# Altium schematic sheet Schematic.schdoc
size 312 x 225 mm
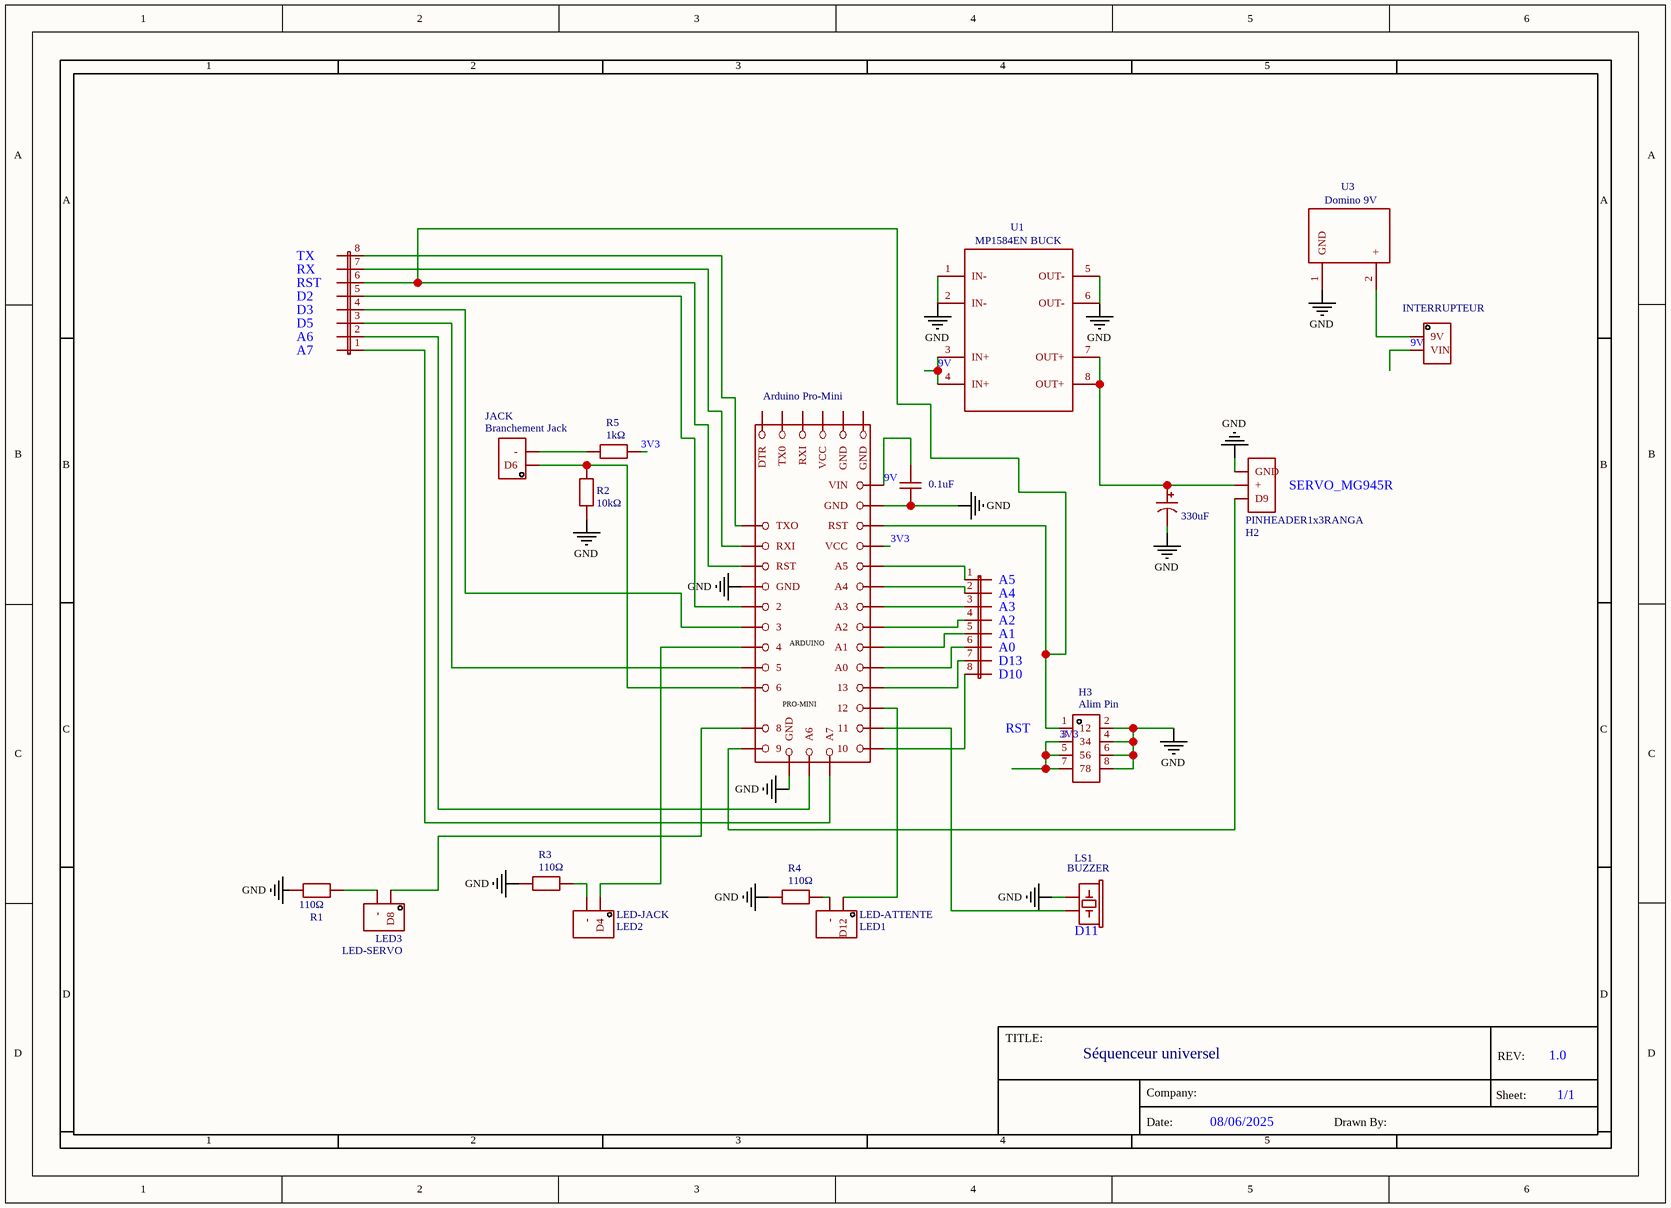
[diagram p0: Schematic.schdoc]

## Parts
C1  330uF  [CAPACITOR, 100UF 2.54MM PIN CAPACITOR]
C2  0.1uF  [CERAMIC CAPACITOR 150MIL]
H2  PINHEADER1x3RANGA  [PINHEADER1X3]
H3  Alim Pin  [HDR-TH_8P-P2.54-V-F-R2-C4-S2.54]
INTERRUPTEUR  KCD1-101A  [PINHEADER1X2]  (value not drawn)
JACK  Branchement Jack  [PINHEADER1X2]
JP1  JUMPER-8-PINS  [CONNECTOR-8-MALE-FEMALE]  (value not drawn)
JP2  JUMPER-8-PINS  [CONNECTOR-8-MALE-FEMALE]  (value not drawn)
LED-ATTENTE  LED1  [PINHEADER1X2]
LED-JACK  LED2  [PINHEADER1X2]
LED-SERVO  LED3  [PINHEADER1X2]
LS1  BUZZER  [BUZZER-12MM-NS]
R1  110Ω  [1W RESISTANCE]
R2  10kΩ  [1W RESISTANCE]
R3  110Ω  [1W RESISTANCE]
R4  110Ω  [1W RESISTANCE]
R5  1kΩ  [1W RESISTANCE]
U1  MP1584EN BUCK  [MP1584EN_MINI_MODULE_BUCK_4.5V-28V]
U2  Arduino Pro-Mini  [ARDUINOPROMINI_ARDUINO_PRO_MINI]
U3  Domino 9V  [PAD_CONN_AWG19]

## Nets
GND: C1.2 C2.1 H2.3(GND) H3.2 H3.4 H3.6 H3.8 LS1.- R1.1 R2.1 R3.1 R4.1 U1.1(IN-) U1.2(IN-) U1.5(OUT-) U1.6(OUT-) U2.GND U2.GND@1(GND) U2.GND@3(GND) U3.1(GND)
3V3: H3.3 H3.5 H3.7 R5.1 U2.VCC
9V: C2.2 INTERRUPTEUR.2(VIN) U1.3(IN+) U1.4(IN+) U2.RAW(VIN)
NetC1_1: C1.1 H2.2(+) U1.7(OUT+) U1.8(OUT+)
NetH2_1: H2.1(D9) U2.D9(9)
NetH3_1: H3.1 JP2.6 U2.RST U2.RST@1(RST)
NetINTERRUPTEUR_1: INTERRUPTEUR.1(9V) U3.2(+)
NetJACK_1: JACK.1(D6) R2.2 U2.D6(6)
NetJACK_2: JACK.2(-) R5.2
NetJP1_1: JP1.1 U2.A5
NetJP1_2: JP1.2 U2.A4
NetJP1_3: JP1.3 U2.A3
NetJP1_4: JP1.4 U2.A2
NetJP1_5: JP1.5 U2.A1
NetJP1_6: JP1.6 U2.A0
NetJP1_7: JP1.7 U2.D13(13)
NetJP1_8: JP1.8 U2.D10(10)
NetJP2_1: JP2.1 U2.A7
NetJP2_2: JP2.2 U2.A6
NetJP2_3: JP2.3 U2.D5(5)
NetJP2_4: JP2.4 U2.D3(3)
NetJP2_5: JP2.5 U2.D2(2)
NetJP2_7: JP2.7 U2.RX(RXI)
NetJP2_8: JP2.8 U2.TX(TXO)
NetLED-ATTENTE_1: LED-ATTENTE.1(D12) U2.D12(12)
NetLED-ATTENTE_2: LED-ATTENTE.2(-) R4.2
NetLED-JACK_1: LED-JACK.1(D4) U2.D4(4)
NetLED-JACK_2: LED-JACK.2(-) R3.2
NetLED-SERVO_1: LED-SERVO.1(D8) U2.D8(8)
NetLED-SERVO_2: LED-SERVO.2(-) R1.2
NetLS1_+: LS1.+ U2.D11(11)

Not connected (* = marked no-connect by the designer): U2 BLK(GND) DTR GND@2(GND) RX@1(RXI) TX@1(TX0) VCC@1(VCC)

## Notes on the sheet
- 1
- 2
- 3
- 4
- 5
- A
- (near JP2) TX
- (near JP2) RX
- (near JP2) RST
- (near JP2) D2
- (near JP2) D3
- (near JP2) D5
- (near JP2) A6
- (near JP2) A7
- B
- (near H2) SERVO_MG945R
- (near JP1) A3
- (near JP1) A4
- (near JP1) A5
- (near JP1) A0
- (near JP1) A1
- (near JP1) A2
- (near JP1) D13
- (near JP1) D10
- C
- RST
- (near LS1) D11
- D
- TITLE:
- Séquenceur universel
- Company:
- REV:
- 1.0
- Date:
- 08/06/2025
- Drawn By:
- Sheet:
- 1/1
- (in symbol Arduino Pro-Mini) ARDUINO; PRO-MINI

## Library data of the parts
C1 = 330uF: Manufacturer: CX(承兴); Manufacturer Part: KM476M016D11RR0VH2FP0; Convert to PCB: yes; nameAlias: Value; Contributor: Reji S; Symbol: 330uF; Device: 330uF; Supplier: LCSC; Supplier Part: C22320; JLCPCB Part Class: Extended Part; Add into BOM: yes; Origin Footprint: CAPACITOR, 100UF 2.54MM PIN CAPACITOR; spicePre: C; spiceSymbolName: CAPACITOR 680UF COPY
C2 = 0.1uF: Manufacturer: ValuePro; Convert to PCB: yes; nameAlias: Capacitance; Contributor: GireeshTS; Symbol: 0.1uF; Device: 0.1uF; Supplier: LCSC; Manufacturer Part: Ceramic capacitor 150mil; Supplier Part: Ceramic capacitor 150mil; Add into BOM: yes; Origin Footprint: CERAMIC CAPACITOR 150MIL; spicePre: C; spiceSymbolName: Ceramic capacitor 150mil
H2 = PINHEADER1x3RANGA: Convert to PCB: yes; Contributor: ranga404; Symbol: PINHEADER1x3RANGA; Device: PINHEADER1x3RANGA; Supplier Part: undefined; Add into BOM: yes; Origin Footprint: PINHEADER1X3; spicePre: H; spiceSymbolName: PINHEADER1x3RANGA
H3 = Alim Pin: Manufacturer: INCP; Symbol: IPCP254M08PB28V; Convert to PCB: yes; Contributor: lcsc; Device: IPCP254M08PB28V; Supplier: LCSC; Supplier Part: C22438440; Manufacturer Part: IPCP254M08PB28V; JLCPCB Part Class: Extended Part; Add into BOM: yes; Origin Footprint: HDR-TH_8P-P2.54-V-F-R2-C4-S2.54; spicePre: H; spiceSymbolName: IPCP254M08PB28V
INTERRUPTEUR = KCD1-101A: Convert to PCB: yes; Contributor: ahosahalli; Symbol: KCD1-101A; Device: KCD1-101A; Supplier Part: undefined; Add into BOM: yes; Origin Footprint: PINHEADER1X2; spicePre: H; spiceSymbolName: PINHEADER1x2
JACK = Branchement Jack: Convert to PCB: yes; Contributor: ahosahalli; Symbol: Branchement Jack; Device: Branchement Jack; Supplier Part: undefined; Add into BOM: yes; Origin Footprint: PINHEADER1X2; spicePre: H; spiceSymbolName: PINHEADER1x2
JP1 JP2 = JUMPER-8-PINS: Convert to PCB: yes; Contributor: dina; Symbol: JUMPER-8-PINS; Device: JUMPER-8-PINS; Add into BOM: yes; Origin Footprint: CONNECTOR-8-MALE-FEMALE; spicePre: J; spiceSymbolName: JUMPER-8-PINS
LED-ATTENTE = LED1: Convert to PCB: yes; Contributor: ahosahalli; Symbol: LED1; Device: LED1; Supplier Part: undefined; Add into BOM: yes; Origin Footprint: PINHEADER1X2; spicePre: H; spiceSymbolName: PINHEADER1x2
LED-JACK = LED2: Convert to PCB: yes; Contributor: ahosahalli; Symbol: LED2; Device: LED2; Supplier Part: undefined; Add into BOM: yes; Origin Footprint: PINHEADER1X2; spicePre: H; spiceSymbolName: PINHEADER1x2
LED-SERVO = LED3: Convert to PCB: yes; Contributor: ahosahalli; Symbol: LED3; Device: LED3; Supplier Part: undefined; Add into BOM: yes; Origin Footprint: PINHEADER1X2; spicePre: H; spiceSymbolName: PINHEADER1x2
LS1 = BUZZER: Symbol: BUZZER-PTH_NO_SILK; Convert to PCB: yes; Contributor: q2friki; Device: BUZZER-PTH_NO_SILK; Add into BOM: yes; Origin Footprint: BUZZER-12MM-NS; spicePre: L; spiceSymbolName: BUZZER-PTH_NO_SILK
R1 R3 R4 = 110Ω: Symbol: 110R; Convert to PCB: yes; Contributor: matheopatino; Device: 110R; Add into BOM: yes; Origin Footprint: 1W RESISTANCE; spicePre: U; spiceSymbolName: R_1W
R2 = 10kΩ: Symbol: 10k; Convert to PCB: yes; Contributor: matheopatino; Device: 10k; Add into BOM: yes; Origin Footprint: 1W RESISTANCE; spicePre: U; spiceSymbolName: R_1W
R5 = 1kΩ: Symbol: 1k; Convert to PCB: yes; Contributor: matheopatino; Device: 1k; Add into BOM: yes; Origin Footprint: 1W RESISTANCE; spicePre: U; spiceSymbolName: R_1W
U1 = MP1584EN BUCK: Convert to PCB: yes; Contributor: maxboudet_pcb; Symbol: MP1584EN_Mini_module_BUCK_4.5V-28V; Device: MP1584EN_Mini_module_BUCK_4.5V-28V; link: https://opencircuit.fr/produit/mp1584en-mini-buck-converter-4.5v-28v-module; Add into BOM: yes; Origin Footprint: MP1584EN_MINI_MODULE_BUCK_4.5V-28V; spicePre: U; spiceSymbolName: MP1584EN_Mini_module_BUCK_4.5V-28V
U2 = Arduino Pro-Mini: Convert to PCB: yes; Contributor: Dawid Karoński; Package Display: No; Symbol: Arduino Pro-Mini; Device: Arduino Pro-Mini; Add into BOM: yes; Origin Footprint: ARDUINOPROMINI_ARDUINO_PRO_MINI; spicePre: U; spiceSymbolName: Arduino Pro-Mini
U3 = Domino 9V: Symbol: PAD_CONN_BATT_LIPO_9V; Convert to PCB: yes; Contributor: maxboudet_pcb; Device: PAD_CONN_BATT_LIPO_9V; Add into BOM: yes; Origin Footprint: PAD_CONN_AWG19; spicePre: U; spiceSymbolName: PAD_CONN_BATT COPY